# Altium project Quadcopter Fligth Controller Board.PrjPcb (part 4 of 7)
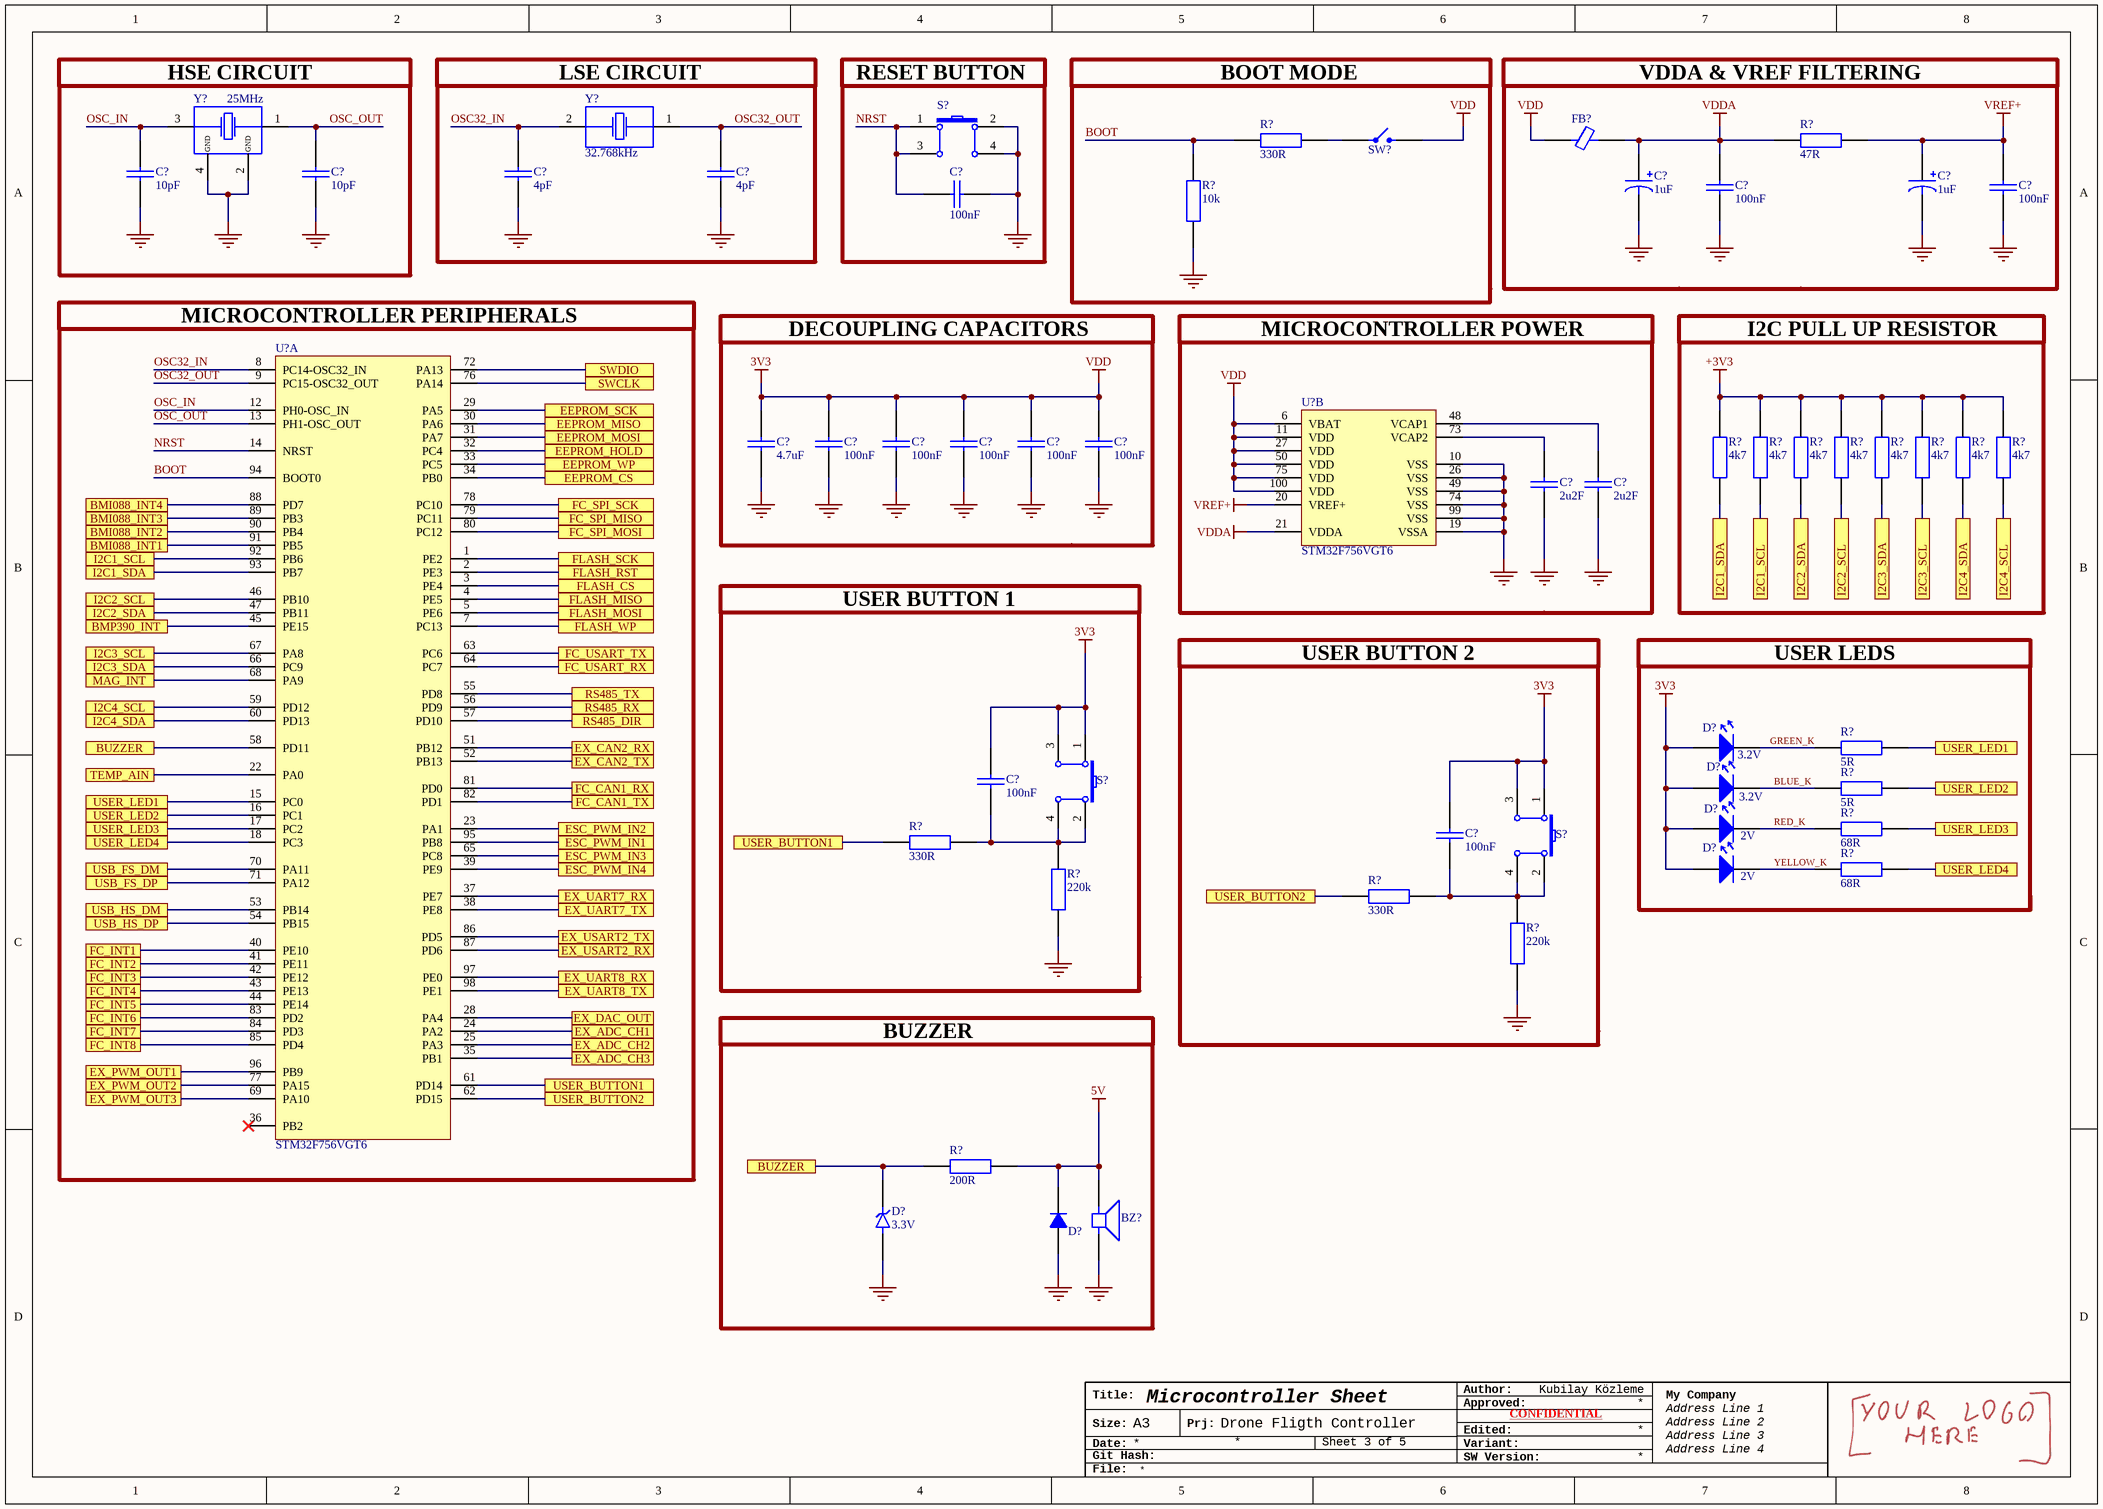
[diagram p6: Microcontroller.SchDoc]

## Sheet Microcontroller.SchDoc: Microcontroller Sheet (continued)

### Library data of the parts
BZ? = CT-1205CL-SMT-TR: 12.8 mm, 5 V, 88 dB, 2.4 kHz, Surface Mount (SMT), Driving Circuit, Magnetic Audio Indicator Buzzer; Manufacturer: CUI Devices; Shape: 4453Shape; Frequency: 2.4kHz; Operating Supply Current: 30mA; Voltage Rating: 5V; Sensing Method: 6241SensingMethod; Input Type: DC; Max Supply Voltage: 7V; Min Supply Voltage: 4V; Designed By: Kubilay Közleme; Supplier 1: Digikey; Manufacturer Part Number: CT-1205CL-SMT-TR; RoHS: No; Category: Buzzers; Stock 1: 39806; Pricing 1: 1=2.24, 10=1.826, 25=1.6836, 50=1.5836, 100=1.4898 (USD); Mount: Surface Mount; Case/Package: 4250Case; Min Operating Temperature: -30°C; Max Operating Temperature: 70°C; Termination: Solder; Packaging: 10Packaging; Series: CT; Current: 30mA; Operating Supply Voltage: 5V; Length: 12.8mm; Width: 12.8mm; Height: 7.6mm; Lead Free: 5697LeadFree; ComponentLink1URL: https://www.cuidevices.com/product/resource/digikeypdf/ct-1205cl-smt-tr.pdf?src-supplier=Digikey; ComponentLink1Description: https://www.cuidevices.com/product/resource/digikeypdf/ct-1205cl-smt-tr.pdf?src-supplier=Digikey; ComponentLink2URL: https://datasheet.octopart.com/CT-1205CL-SMT-TR-CUI-datasheet-16178015.pdf?src-supplier=Future+Electronics; ComponentLink2Description: https://datasheet.octopart.com/CT-1205CL-SMT-TR-CUI-datasheet-16178015.pdf?src-supplier=Future+Electronics; ComponentLink3URL: https://datasheet.octopart.com/CT-1205CL-SMT-TR-CUI-Devices-datasheet-141000055.pdf?src-supplier=Master+Electronics; ComponentLink3Description: https://datasheet.octopart.com/CT-1205CL-SMT-TR-CUI-Devices-datasheet-141000055.pdf?src-supplier=Master+Electronics; Supplier Part Number 1: 102-1267-6-ND
C?#29 C?#30 = CAP CER 10pF 0603: Ceramic Capacitor, Multilayer, Ceramic, 25V, 5% +Tol, 5% -Tol, C0G, 30ppm/Cel TC, 0.00001uF, Surface Mount, 0201; Manufacturer: KEMET; Multilayer: Yes; Designed By: Kubilay Közleme; Supplier 1: Digikey; Manufacturer Part Number: C0201C100D3GACTU; RoHS: Yes; Category: Ceramic Capacitors; Stock 1: 675000; Pricing 1: 15000=0.00535, 30000=0.00485, 45000=0.0046, 75000=0.00432, 105000=0.00416, 150000=0.004, 375000=0.00366, 750000=0.00345, 1500000=0.00328 (USD); Mount: Surface Mount; Number of Pins: 2; Dielectric Material: Ceramic; Package Shape: Rectangular; Size Code: 0201; Terminal Finish: Nickel; Min Operating Temperature: -55°C; Max Operating Temperature: 125°C; JESD-609 Code: e3; Capacitor Type: Ceramic; Negative Tolerance: 5%; Package Style: SMTMeter; Packaging: Tape and Reel; Positive Tolerance: 5%; Rated DC Voltage (URdc): 25V; Series: C(SIZE)C(C0G); Temperature Characteristics Code: C0G; Termination: Wraparound; Length: 0.6mm; Width: 0.3mm; Height: 0.3mm; Reach SVHC Compliant: Yes; RoHS Compliant: Yes; ComponentLink1URL: https://datasheet.ciiva.com:443/pdfs/VipMasterIC/IC/KEME/KEME-S-A0002525876/KEME-S-A0002525876-1.pdf?src-supplier=IHS+Markit; ComponentLink1Description: https://datasheet.ciiva.com:443/pdfs/VipMasterIC/IC/KEME/KEME-S-A0002525876/KEME-S-A0002525876-1.pdf?src-supplier=IHS+Markit; ComponentLink2URL: http://www.farnell.com/datasheets/2745865.pdf?src-supplier=Farnell; ComponentLink2Description: http://www.farnell.com/datasheets/2745865.pdf?src-supplier=Farnell; ComponentLink3URL: http://www.mouser.com/ds/2/212/KEM_C1003_C0G_SMD-1101588.pdf?src-supplier=Mouser; ComponentLink3Description: http://www.mouser.com/ds/2/212/KEM_C1003_C0G_SMD-1101588.pdf?src-supplier=Mouser; ComponentLink4URL: https://datasheet.octopart.com/C0201C100D3GACTU-KEMET-datasheet-81638339.pdf?src-supplier=Newark; ComponentLink4Description: https://datasheet.octopart.com/C0201C100D3GACTU-KEMET-datasheet-81638339.pdf?src-supplier=Newark; ComponentLink5URL: https://datasheet.octopart.com/C0201C100D3GACTU-Kemet-datasheet-62058854.pdf?src-supplier=Element14; ComponentLink5Description: https://datasheet.octopart.com/C0201C100D3GACTU-Kemet-datasheet-62058854.pdf?src-supplier=Element14; ComponentLink6URL: http://datasheet.octopart.com/C0201C100D3GACTU-KEMET-datasheet-68331921.pdf?src-supplier=Avnet; ComponentLink6Description: http://datasheet.octopart.com/C0201C100D3GACTU-KEMET-datasheet-68331921.pdf?src-supplier=Avnet; ComponentLink7URL: http://datasheet.octopart.com/C0201C100D3GACTU-KEMET-datasheet-68331921.pdf?src-supplier=Onlinecomponents.com; ComponentLink7Description: http://datasheet.octopart.com/C0201C100D3GACTU-KEMET-datasheet-68331921.pdf?src-supplier=Onlinecomponents.com; ComponentLink8URL: http://datasheet.octopart.com/C0201C100D3GACTU-KEMET-datasheet-68331921.pdf?src-supplier=Digikey; ComponentLink8Description: http://datasheet.octopart.com/C0201C100D3GACTU-KEMET-datasheet-68331921.pdf?src-supplier=Digikey; ComponentLink9URL: https://api.kemet.com/component-edge/download/datasheet/C0201C100D3GACTU.pdf?src-supplier=Digikey; ComponentLink9Description: https://api.kemet.com/component-edge/download/datasheet/C0201C100D3GACTU.pdf?src-supplier=Digikey; ComponentLink10URL: https://datasheet.octopart.com/C0201C100D3GACTU-KEMET-datasheet-165572914.pdf?src-supplier=TME; ComponentLink10Description: https://datasheet.octopart.com/C0201C100D3GACTU-KEMET-datasheet-165572914.pdf?src-supplier=TME; ComponentLink11URL: http://datasheet.octopart.com/C0201C100D3GACTU-KEMET-datasheet-68331921.pdf?src-supplier=TTI; ComponentLink11Description: http://datasheet.octopart.com/C0201C100D3GACTU-KEMET-datasheet-68331921.pdf?src-supplier=TTI; ComponentLink12URL: https://datasheet.octopart.com/C0201C100D3GACTU-KEMET-datasheet-157246123.pdf?src-supplier=Electro+Sonic; ComponentLink12Description: https://datasheet.octopart.com/C0201C100D3GACTU-KEMET-datasheet-157246123.pdf?src-supplier=Electro+Sonic
C?#31 C?#32 = CAP TANT 1uF 0805: Tantalum Capacitor, Polarized, Tantalum (solid Polymer), 35V, 20% +Tol, 20% -Tol, 1uF, Surface Mount, 0805; Manufacturer: Vishay; Designed By: Kubilay Közleme; Supplier 1: Digikey; Manufacturer Part Number: T58W9105M035C0500; RoHS: Yes; Category: Polymer Capacitors; Stock 1: 13915; Pricing 1: 1=0.5, 10=0.349, 50=0.2942, 100=0.2396, 500=0.19966, 1000=0.185 (USD); Number of Pins: 2; Dielectric Material: Polymer; Capacitor Type: Tantalum; RoHS Compliant: Yes; ComponentLink1URL: https://datasheet.ciiva.com:443/pdfs/VipMasterIC/IC/VISH/VISH-S-A0007978004/VISH-S-A0007978004-1.pdf?src-supplier=IHS+Markit; ComponentLink1Description: https://datasheet.ciiva.com:443/pdfs/VipMasterIC/IC/VISH/VISH-S-A0007978004/VISH-S-A0007978004-1.pdf?src-supplier=IHS+Markit; ComponentLink2URL: http://www.farnell.com/datasheets/2617265.pdf?src-supplier=Farnell; ComponentLink2Description: http://www.farnell.com/datasheets/2617265.pdf?src-supplier=Farnell; ComponentLink3URL: http://www.farnell.com/datasheets/2617265.pdf?src-supplier=Newark; ComponentLink3Description: http://www.farnell.com/datasheets/2617265.pdf?src-supplier=Newark; ComponentLink4URL: http://www.farnell.com/datasheets/2617265.pdf?src-supplier=Element14; ComponentLink4Description: http://www.farnell.com/datasheets/2617265.pdf?src-supplier=Element14; ComponentLink5URL: https://datasheet.octopart.com/T58W9105M035C0500-Vishay-datasheet-76796261.pdf?src-supplier=Element14; ComponentLink5Description: https://datasheet.octopart.com/T58W9105M035C0500-Vishay-datasheet-76796261.pdf?src-supplier=Element14; ComponentLink6URL: http://www.vishay.com/docs/40189/t58.pdf?src-supplier=Digikey; ComponentLink6Description: http://www.vishay.com/docs/40189/t58.pdf?src-supplier=Digikey; ComponentLink7URL: https://www.vishay.com/docs/40189/t58.pdf?src-supplier=Digikey; ComponentLink7Description: https://www.vishay.com/docs/40189/t58.pdf?src-supplier=Digikey; ComponentLink8URL: https://datasheet.octopart.com/T58W9105M035C0500-Vishay-datasheet-95510002.pdf?src-supplier=Future+Electronics; ComponentLink8Description: https://datasheet.octopart.com/T58W9105M035C0500-Vishay-datasheet-95510002.pdf?src-supplier=Future+Electronics; Supplier Part Number 1: 718-2209-6-ND
C?#33 C?#36 C?#37 C?#39-C?#43 C?#46 C?#47 = CAP CER 100nF 0603: Cap Cer 0603 0.1UF 100VDC X7R; Manufacturer: KEMET; Dielectric: 1511DielectricType; Voltage Rating (DC): 100V; Designed By: Kubilay Közleme; Supplier 1: Digikey; Manufacturer Part Number: C0603C104K1RACTU; RoHS: No; Category: Ceramic Capacitors; Stock 1: 10169; Pricing 1: 1=0.28, 10=0.185, 50=0.1296, 100=0.1047, 500=0.07782, 1000=0.06808 (USD); Case/Package: 345Case; Supplier Part Number 1: 399-C0603C104K1RACTUCT-ND
C?#34 C?#35 = CAP CER 4pF 0603: Ceramic Capacitor, Multilayer, Ceramic, 50V, 2.5% +Tol, 2.5% -Tol, C0G, -/+30ppm/Cel TC, 0.000004uF, Surface Mount, 0603; Manufacturer: KEMET; Multilayer: Yes; Designed By: Kubilay Közleme; Supplier 1: Digikey; Manufacturer Part Number: CBR06C409B5GAC; RoHS: Yes; Category: Ceramic Capacitors; Stock 1: 15317; Pricing 1: 1=0.18, 10=0.119, 50=0.075, 100=0.0601, 500=0.04338, 1000=0.03838 (USD); Mount: Surface Mount; Number of Pins: 2; Dielectric Material: Ceramic; Package Shape: Rectangular; Size Code: 0603; Min Operating Temperature: -55°C; Max Operating Temperature: 125°C; Capacitor Type: Ceramic; Negative Tolerance: 2.5%; Package Style: SMTMeter; Packaging: Tape and Reel; Positive Tolerance: 2.5%; Rated DC Voltage (URdc): 50V; Temperature Characteristics Code: C0G; Termination: Wraparound; Length: 1.6mm; Width: 0.8mm; Height: 0.8mm; Reach SVHC Compliant: Yes; RoHS Compliant: Yes; ComponentLink1URL: https://datasheet.ciiva.com:443/pdfs/VipMasterIC/IC/KEME/KEME-S-A0008534334/KEME-S-A0008534334-1.pdf?src-supplier=IHS+Markit; ComponentLink1Description: https://datasheet.ciiva.com:443/pdfs/VipMasterIC/IC/KEME/KEME-S-A0008534334/KEME-S-A0008534334-1.pdf?src-supplier=IHS+Markit; ComponentLink2URL: https://datasheet.ciiva.com/24220/kem-c1030-cbr-smd-346920-24220453.pdf?src-supplier=Mouser; ComponentLink2Description: https://datasheet.ciiva.com/24220/kem-c1030-cbr-smd-346920-24220453.pdf?src-supplier=Mouser; ComponentLink3URL: https://datasheet.ciiva.com/6259/kem-c1030-cbr-smd-6259846.pdf?src-supplier=Digikey; ComponentLink3Description: https://datasheet.ciiva.com/6259/kem-c1030-cbr-smd-6259846.pdf?src-supplier=Digikey; Supplier Part Number 1: 399-CBR06C409B5GACCT-ND
C?#38 = CAP CER 4.7uF 0805: Multilayer Ceramic Capacitor, 4.7 uF, 25 V, ± 10%, X5R, 0805 [2012 Metric]; Manufacturer: Samsung; Voltage Rating: 25V; Designed By: Kubilay Közleme; Supplier 1: Digikey; Manufacturer Part Number: CL21A475KAQNNNE; RoHS: Yes; Category: Ceramic Capacitors; Stock 1: 3035721; Pricing 1: 1=0.1, 10=0.069, 50=0.0414, 100=0.0326, 500=0.02408, 1000=0.01994 (USD); Mount: Surface Mount; Case/Package: 0805; Case Code (Metric): 2012; Case Code (Imperial): 0805; Material: Ceramic; Min Operating Temperature: -55°C; Max Operating Temperature: 85°C; Packaging: Tape and Reel; Tolerance: 10%; Dielectric: X5R; Voltage Rating (DC): 25V; Series: CL; Construction: Flat; Length: 2mm; Height: 1.25mm; Depth: 1.25mm; Radiation Hardening: No; Lead Free: Lead Free; RoHS Compliant: Yes; ComponentLink1URL: https://datasheet.ciiva.com/25798/cl21a475kaqnnne-25798882.pdf?src-supplier=Digikey; ComponentLink1Description: https://datasheet.ciiva.com/25798/cl21a475kaqnnne-25798882.pdf?src-supplier=Digikey; Supplier Part Number 1: 1276-1244-1-ND
C?#44 C?#45 = CAP CER 2.2uF 0603: Ceramic Capacitor, Multilayer, Ceramic, 16V, 10% +Tol, 10% -Tol, X5R, 15% TC, 2.2uF, Surface Mount, 0603; Manufacturer: Samsung; Multilayer: Yes; Designed By: Kubilay Közleme; Supplier 1: Digikey; Manufacturer Part Number: CL10A225KO8NNNC; RoHS: Yes; Category: Ceramic Capacitors; Stock 1: 909178; Pricing 1: 1=0.1, 10=0.06, 50=0.0346, 100=0.0269, 500=0.02022, 1000=0.01589 (USD); Mount: Surface Mount; Number of Pins: 2; Dielectric Material: Ceramic; Package Shape: Rectangular; Size Code: 0603; Terminal Finish: Nickel; Min Operating Temperature: -55°C; Max Operating Temperature: 85°C; JESD-609 Code: e3; Capacitor Type: Ceramic; Negative Tolerance: 10%; Package Style: SMTMeter; Packaging: Tape and Reel; Positive Tolerance: 10%; Rated DC Voltage (URdc): 16V; Temperature Characteristics Code: X5R; Termination: Wraparound; Length: 1.6mm; Width: 0.8mm; Height: 0.9mm; Reach SVHC Compliant: Yes; RoHS Compliant: Yes; ComponentLink1URL: https://datasheet.ciiva.com:443/pdfs/VipMasterIC/IC/SEMS/SEMS-S-A0008524842/SEMS-S-A0008524788-1.pdf?src-supplier=IHS+Markit; ComponentLink1Description: https://datasheet.ciiva.com:443/pdfs/VipMasterIC/IC/SEMS/SEMS-S-A0008524842/SEMS-S-A0008524788-1.pdf?src-supplier=IHS+Markit; ComponentLink2URL: https://datasheet.ciiva.com/25798/cl10a225ko8nnnc-25798421.pdf?src-supplier=Digikey; ComponentLink2Description: https://datasheet.ciiva.com/25798/cl10a225ko8nnnc-25798421.pdf?src-supplier=Digikey; ComponentLink3URL: https://datasheet.ciiva.com/26838/getdatasheetpartid-355165-26838356.pdf?src-supplier=Verical; ComponentLink3Description: https://datasheet.ciiva.com/26838/getdatasheetpartid-355165-26838356.pdf?src-supplier=Verical; ComponentLink4URL: https://datasheet.ciiva.com/29198/457919-da-01-en-vs-kondensator-0603-29198587.pdf?src-supplier=Conrad; ComponentLink4Description: https://datasheet.ciiva.com/29198/457919-da-01-en-vs-kondensator-0603-29198587.pdf?src-supplier=Conrad; ComponentLink5URL: https://datasheet.ciiva.com/16342/cl05b104kq5nnnc-16342714.pdf?src-supplier=Future+Electronics; ComponentLink5Description: https://datasheet.ciiva.com/16342/cl05b104kq5nnnc-16342714.pdf?src-supplier=Future+Electronics; Supplier Part Number 1: 1276-1040-6-ND
D?#2 = LED GREEN CLEAR 0603 SMD: Single Color LED, Green, Water Clear, 1.1mm; Manufacturer: Wurth Electronics; Shape: Rectangular; Forward Current-Max: 30mA; Luminous Intensity-Nom: 430mcd; Number of Functions: 1; Viewing Angle: 140°; Overall Height: 0.7mm; Designed By: Kubilay Közleme; Supplier 1: Digikey; Manufacturer Part Number: 150060GS75000; RoHS: Yes; Category: LEDs; Stock 1: 166680; Pricing 1: 1=0.15, 50=0.142, 100=0.122, 500=0.105 (USD); Mount: Surface Mount; Number of Pins: 2; Color: Green; Min Operating Temperature: -40°C; Max Operating Temperature: 85°C; Lens Style: WATER CLEAR; Optoelectronic Device Type: SINGLE COLOR LED; Packaging: Tape and Reel; Size: 1.1mm; Terminal Pitch: 1.6mm; Reach SVHC Compliant: Yes; RoHS Compliant: Yes; ComponentLink1URL: https://datasheet.ciiva.com:443/pdfs/VipMasterIC/IC/MIDC/MIDC-S-A0007790169/MIDC-S-A0007790169-1.pdf?src-supplier=IHS+Markit; ComponentLink1Description: https://datasheet.ciiva.com:443/pdfs/VipMasterIC/IC/MIDC/MIDC-S-A0007790169/MIDC-S-A0007790169-1.pdf?src-supplier=IHS+Markit; ComponentLink2URL: https://datasheet.ciiva.com/29562/150060gs75000-29562868.pdf?src-supplier=Digikey; ComponentLink2Description: https://datasheet.ciiva.com/29562/150060gs75000-29562868.pdf?src-supplier=Digikey; ComponentLink3URL: https://datasheet.ciiva.com/29279/759427-da-01-en-chipled-0603-w-kl-gruen-150060gs75000-29279201.pdf?src-supplier=Conrad; ComponentLink3Description: https://datasheet.ciiva.com/29279/759427-da-01-en-chipled-0603-w-kl-gruen-150060gs75000-29279201.pdf?src-supplier=Conrad; ComponentLink4URL: https://datasheet.ciiva.com/29562/150060gs75000-29562869.pdf?src-supplier=Digikey; ComponentLink4Description: https://datasheet.ciiva.com/29562/150060gs75000-29562869.pdf?src-supplier=Digikey; ComponentLink5URL: https://datasheet.ciiva.com/29562/150060gs75000-29562870.pdf?src-supplier=Digikey; ComponentLink5Description: https://datasheet.ciiva.com/29562/150060gs75000-29562870.pdf?src-supplier=Digikey; Supplier Part Number 1: 732-4971-1-ND
D?#3 = LED BLUE CLEAR 0603 SMD: Single Color LED, Blue, Water Clear, 1.1mm; Manufacturer: Wurth Electronics; Manufacturer Part Number: 150060BS75000; Shape: Rectangular; Forward Current-Max: 30mA; Luminous Intensity-Nom: 145mcd; Number of Functions: 1; Viewing Angle: 140°; Overall Height: 0.7mm; Designed By: Kubilay Közleme; Supplier 1: Digikey; RoHS: Yes; Category: LEDs; Stock 1: 59212; Pricing 1: 1=0.16, 50=0.155, 100=0.133, 500=0.115 (USD); Mount: Surface Mount; Number of Pins: 2; Color: Blue; Min Operating Temperature: -40°C; Max Operating Temperature: 85°C; Lens Style: WATER CLEAR; Optoelectronic Device Type: SINGLE COLOR LED; Packaging: Tape and Reel; Size: 1.1mm; Terminal Pitch: 1.6mm; Reach SVHC Compliant: Yes; RoHS Compliant: Yes; ComponentLink1URL: https://datasheet.ciiva.com:443/pdfs/VipMasterIC/IC/MIDC/MIDC-S-A0007768854/MIDC-S-A0007768854-1.pdf?src-supplier=IHS+Markit; ComponentLink1Description: https://datasheet.ciiva.com:443/pdfs/VipMasterIC/IC/MIDC/MIDC-S-A0007768854/MIDC-S-A0007768854-1.pdf?src-supplier=IHS+Markit; ComponentLink2URL: https://datasheet.ciiva.com/29563/150060bs75000-29563034.pdf?src-supplier=Digikey; ComponentLink2Description: https://datasheet.ciiva.com/29563/150060bs75000-29563034.pdf?src-supplier=Digikey; ComponentLink3URL: https://datasheet.ciiva.com/29279/759426-da-01-en-chipled-0603-w-kl-blau-150060bs75000-29279193.pdf?src-supplier=Conrad; ComponentLink3Description: https://datasheet.ciiva.com/29279/759426-da-01-en-chipled-0603-w-kl-blau-150060bs75000-29279193.pdf?src-supplier=Conrad; ComponentLink4URL: https://datasheet.ciiva.com/22656/1911343-22656939.pdf?src-supplier=Element14; ComponentLink4Description: https://datasheet.ciiva.com/22656/1911343-22656939.pdf?src-supplier=Element14; ComponentLink5URL: https://datasheet.ciiva.com/48430/150060bs75000-eng-tds-48430039.pdf?src-supplier=Distrelec; ComponentLink5Description: https://datasheet.ciiva.com/48430/150060bs75000-eng-tds-48430039.pdf?src-supplier=Distrelec; ComponentLink6URL: https://datasheet.ciiva.com/29563/150060bs75000-29563035.pdf?src-supplier=Digikey; ComponentLink6Description: https://datasheet.ciiva.com/29563/150060bs75000-29563035.pdf?src-supplier=Digikey; ComponentLink7URL: https://datasheet.ciiva.com/29563/150060bs75000-29563036.pdf?src-supplier=Digikey; ComponentLink7Description: https://datasheet.ciiva.com/29563/150060bs75000-29563036.pdf?src-supplier=Digikey; Supplier Part Number 1: 732-4966-6-ND
D?#4 = LED RED CLEAR 0603 SMD: Single Color LED, Red, Water Clear, 1.1mm; Manufacturer: Wurth Electronics; Shape: Rectangular; Forward Current-Max: 30mA; Luminous Intensity-Nom: 250mcd; Number of Functions: 1; Viewing Angle: 140°; Overall Height: 0.7mm; Designed By: Kubilay Közleme; Supplier 1: Digikey; Manufacturer Part Number: 150060RS75000; RoHS: Yes; Category: LEDs; Stock 1: 140000; Pricing 1: 4000=0.105 (USD); Mount: Surface Mount; Number of Pins: 2; Color: Red; Min Operating Temperature: -40°C; Max Operating Temperature: 85°C; Lens Style: WATER CLEAR; Optoelectronic Device Type: SINGLE COLOR LED; Packaging: Tape and Reel; Size: 1.1mm; Terminal Pitch: 1.6mm; Reach SVHC Compliant: Yes; RoHS Compliant: Yes; ComponentLink1URL: https://datasheet.ciiva.com:443/pdfs/VipMasterIC/IC/MIDC/MIDC-S-A0007768849/MIDC-S-A0007768849-1.pdf?src-supplier=IHS+Markit; ComponentLink1Description: https://datasheet.ciiva.com:443/pdfs/VipMasterIC/IC/MIDC/MIDC-S-A0007768849/MIDC-S-A0007768849-1.pdf?src-supplier=IHS+Markit; ComponentLink2URL: https://datasheet.ciiva.com/29563/150060rs75000-29563040.pdf?src-supplier=Digikey; ComponentLink2Description: https://datasheet.ciiva.com/29563/150060rs75000-29563040.pdf?src-supplier=Digikey; ComponentLink3URL: https://datasheet.ciiva.com/29279/759428-da-01-en-chipled-0603-w-kl-rot-150060rs75000-29279196.pdf?src-supplier=Conrad; ComponentLink3Description: https://datasheet.ciiva.com/29279/759428-da-01-en-chipled-0603-w-kl-rot-150060rs75000-29279196.pdf?src-supplier=Conrad; Supplier Part Number 1: 732-4978-2-ND
D?#5 = LED YELLOW CLEAR 0603 SMD: Single Color LED, Yellow, Water Clear, 1.1mm; Manufacturer: Wurth Electronics; Manufacturer Part Number: 150060YS75000; Shape: Rectangular; Forward Current-Max: 30mA; Luminous Intensity-Nom: 120mcd; Number of Functions: 1; Viewing Angle: 140°; Overall Height: 0.7mm; Designed By: Kubilay Közleme; Supplier 1: Digikey; RoHS: Yes; Category: LEDs; Stock 1: 45913; Pricing 1: 1=0.15, 50=0.142, 100=0.122, 500=0.105 (USD); Mount: Surface Mount; Number of Pins: 2; Color: Yellow; Min Operating Temperature: -40°C; Max Operating Temperature: 85°C; Lens Style: WATER CLEAR; Optoelectronic Device Type: SINGLE COLOR LED; Packaging: Tape and Reel; Size: 1.1mm; Terminal Pitch: 1.6mm; Reach SVHC Compliant: Yes; RoHS Compliant: Yes; ComponentLink1URL: https://datasheet.ciiva.com:443/pdfs/VipMasterIC/IC/MIDC/MIDC-S-A0007768628/MIDC-S-A0007768628-1.pdf?src-supplier=IHS+Markit; ComponentLink1Description: https://datasheet.ciiva.com:443/pdfs/VipMasterIC/IC/MIDC/MIDC-S-A0007768628/MIDC-S-A0007768628-1.pdf?src-supplier=IHS+Markit; ComponentLink2URL: https://datasheet.ciiva.com/23843/150060ys75000-23843250.pdf?src-supplier=Newark; ComponentLink2Description: https://datasheet.ciiva.com/23843/150060ys75000-23843250.pdf?src-supplier=Newark; ComponentLink3URL: https://datasheet.ciiva.com/29279/759432-da-01-en-chipled-0603-w-kl-gelb-150060ys75000-29279206.pdf?src-supplier=Conrad; ComponentLink3Description: https://datasheet.ciiva.com/29279/759432-da-01-en-chipled-0603-w-kl-gelb-150060ys75000-29279206.pdf?src-supplier=Conrad; ComponentLink4URL: https://datasheet.ciiva.com/22656/1911348-22656951.pdf?src-supplier=Element14; ComponentLink4Description: https://datasheet.ciiva.com/22656/1911348-22656951.pdf?src-supplier=Element14; ComponentLink5URL: https://datasheet.ciiva.com/48430/150060ys75000-eng-tds-48430044.pdf?src-supplier=Distrelec; ComponentLink5Description: https://datasheet.ciiva.com/48430/150060ys75000-eng-tds-48430044.pdf?src-supplier=Distrelec; ComponentLink6URL: https://datasheet.ciiva.com/29563/150060ys75000-29563045.pdf?src-supplier=Digikey; ComponentLink6Description: https://datasheet.ciiva.com/29563/150060ys75000-29563045.pdf?src-supplier=Digikey; ComponentLink7URL: https://datasheet.ciiva.com/29563/150060ys75000-29563033.pdf?src-supplier=Digikey; ComponentLink7Description: https://datasheet.ciiva.com/29563/150060ys75000-29563033.pdf?src-supplier=Digikey; Supplier Part Number 1: 732-4981-6-ND
D?#6 = 1N4148WS: Diode Ultra Fast Recovery Rectifier 75V 0.15A; Manufacturer: ON Semiconductor / Fairchild; Max Forward Surge Current (Ifsm): 2A; Forward Current: 150mA; Max Reverse Current: 5uA; Capacitance: 4pF; Reverse Recovery Time: 4ns; Element Configuration: Single; Designed By: Kubilay Közleme; Supplier 1: Digikey; Manufacturer Part Number: 1N4148WS; RoHS: Yes; Category: Rectifier Diodes; Stock 1: 304046; Pricing 1: 1=0.17, 10=0.104, 100=0.0639, 500=0.04644, 1000=0.04076 (USD); Mount: Surface Mount; Number of Pins: 2; Weight: 0.0276g; Min Operating Temperature: -55°C; Max Operating Temperature: 150°C; Max Repetitive Reverse Voltage (Vrrm): 75V; Reverse Voltage: 75V; Packaging: Tape and Reel; Average Rectified Current: 150mA; Max Reverse Voltage (DC): 75V; Series: -; Package Quantity: 1; Recovery Time: 4ns; Length: 1.8mm; Width: 1.35mm; Height: 1mm; Radiation Hardening: No; RoHS Compliant: Yes; Reach SVHC Compliant: No; Lead Free: 5697LeadFree; ComponentLink1URL: https://datasheet.ciiva.com/15208/getdatasheetpartid-127819-15208358.pdf?src-supplier=Verical; ComponentLink1Description: https://datasheet.ciiva.com/15208/getdatasheetpartid-127819-15208358.pdf?src-supplier=Verical; Supplier Part Number 1: 1N4148WSFSCT-ND
D?#7 = MMSZ4684T1G: Diode Zener Single 3.3V 5% 500mW Automotive 2-Pin SOD-123 T/R; Manufacturer: ON Semiconductor; Forward Voltage: 900mV; Max Reverse Leakage Current: 7.5uA; Zener Current: 50uA; Designed By: Kubilay Közleme; Supplier 1: Newark; Manufacturer Part Number: MMSZ4684T1G; RoHS: Yes; Category: Zener Diodes; Stock 1: 27354; Pricing 1: 1=0.022, 25=0.022, 50=0.022, 100=0.022, 250=0.022, 500=0.022, 1000=0.022 (USD); Case/Package: SOD-123-2; Number of Pins: 2; Min Operating Temperature: -55°C; Max Operating Temperature: 150°C; Package Quantity: 3000; Tolerance: 5%; Max Power Dissipation: 500mW; Packaging: Tape and Reel; Voltage Tolerance: 5%; Power Dissipation: 500mW; Test Current: 50uA; Working Voltage: 3.3V; Max Reverse Current: 7.5uA; Series: -; Length: 2.69mm; Width: 1.6mm; Height: 1.12mm; Radiation Hardening: No; Reach SVHC Compliant: No; RoHS Compliant: Yes; ComponentLink1URL: https://datasheet.ciiva.com/27056/2011643-27056163.pdf?src-supplier=Jameco; ComponentLink1Description: https://datasheet.ciiva.com/27056/2011643-27056163.pdf?src-supplier=Jameco; ComponentLink2URL: https://datasheet.ciiva.com/8026/mmsz4678t1-d-8026831.pdf?src-supplier=Element14; ComponentLink2Description: https://datasheet.ciiva.com/8026/mmsz4678t1-d-8026831.pdf?src-supplier=Element14; ComponentLink3URL: https://datasheet.ciiva.com/22697/1796559-22697911.pdf?src-supplier=Element14; ComponentLink3Description: https://datasheet.ciiva.com/22697/1796559-22697911.pdf?src-supplier=Element14; ComponentLink4URL: https://datasheet.ciiva.com/8346/mmsz4678t1-d-8346063.pdf?src-supplier=Avnet; ComponentLink4Description: https://datasheet.ciiva.com/8346/mmsz4678t1-d-8346063.pdf?src-supplier=Avnet; Supplier Part Number 1: 45J1578
FB?#2 = FCM 1608KF-601T03: 600 Ohms @ 100 Mhz 1 Power, Sign; Manufacturer: Tai Tech; Designed By: Kubilay Közleme; Supplier 1: Digikey; Manufacturer Part Number: FCM1608KF-601T03; RoHS: No; Category: Ferrite Beads and Chips; Stock 1: 32683; Pricing 1: 1=0.1, 10=0.025, 25=0.0224, 50=0.0202, 100=0.0182, 250=0.01332, 500=0.0097, 1000=0.00949 (USD); Supplier Part Number 1: 4816-FCM1608KF-601T03CT-ND
R?#10 R?#24 R?#26 = RES 330 OHM 0603: Fixed Resistor, Metal Glaze/thick Film, 0.1W, 330ohm, 75V, 5% +/-Tol, 100ppm/Cel, Surface Mount, 0603; Manufacturer: Yageo; Additional Feature: LASER TRIMMABLE; Rated Power Dissipation (P): 100mW; Rated Temperature: 70°C; Temperature Coefficient: 100ppm/°C; Package Height: 0.45mm; Package Length: 1.6mm; Package Width: 0.8mm; Designed By: Kubilay Közleme; Supplier 1: Digikey; Manufacturer Part Number: RC0603JR-07330RL; RoHS: Yes; Category: Chip SMD Resistors; Stock 1: 2658618; Pricing 1: 1=0.1, 10=0.011, 50=0.0066, 100=0.0054, 500=0.00364, 1000=0.0031 (USD); Mount: Surface Mount; Number of Pins: 2; Package Shape: Rectangular; Size Code: 0603; Terminal Finish: Nickel; Min Operating Temperature: -55°C; Max Operating Temperature: 155°C; Tolerance: 5%; JESD-609 Code: e3; Resistor Type: FIXED RESISTOR; Construction: Chip; Package Style: SMTMeter; Packaging: Tape and Reel; Technology: METAL GLAZE/THICK FILM; Termination: Wraparound; Working Voltage: 75V; Reach SVHC Compliant: Yes; RoHS Compliant: Yes; ComponentLink1URL: https://datasheet.ciiva.com:443/pdfs/VipMasterIC/IC/YAGO/YAGO-S-A0008145938/YAGO-S-A0008145938-1.pdf?src-supplier=IHS+Markit; ComponentLink1Description: https://datasheet.ciiva.com:443/pdfs/VipMasterIC/IC/YAGO/YAGO-S-A0008145938/YAGO-S-A0008145938-1.pdf?src-supplier=IHS+Markit; ComponentLink2URL: https://datasheet.ciiva.com/46395/443971-46395145.pdf?src-supplier=Element14; ComponentLink2Description: https://datasheet.ciiva.com/46395/443971-46395145.pdf?src-supplier=Element14; ComponentLink3URL: https://datasheet.ciiva.com/12558/rc0603-272842-12558685.pdf?src-supplier=Mouser; ComponentLink3Description: https://datasheet.ciiva.com/12558/rc0603-272842-12558685.pdf?src-supplier=Mouser; ComponentLink4URL: https://datasheet.ciiva.com/7746/1868787-7746487.pdf?src-supplier=Element14; ComponentLink4Description: https://datasheet.ciiva.com/7746/1868787-7746487.pdf?src-supplier=Element14; ComponentLink5URL: https://datasheet.ciiva.com/7746/443971-7746488.pdf?src-supplier=Element14; ComponentLink5Description: https://datasheet.ciiva.com/7746/443971-7746488.pdf?src-supplier=Element14; Supplier Part Number 1: 311-330GRDKR-ND
R?#11 = RES 47 OHM 0603: Fixed Resistor, Metal Glaze/thick Film, 0.1W, 47ohm, 75V, 1% +/-Tol, 100ppm/Cel, Surface Mount, 0603; Manufacturer: Yageo; Additional Feature: LASER TRIMMABLE; Rated Power Dissipation (P): 100mW; Rated Temperature: 70°C; Temperature Coefficient: 100ppm/°C; Package Height: 0.45mm; Package Length: 1.6mm; Package Width: 0.8mm; Designed By: Kubilay Közleme; Supplier 1: Digikey; Manufacturer Part Number: RC0603FR-0747RL; RoHS: Yes; Category: Chip SMD Resistors; Stock 1: 662719; Pricing 1: 1=0.1, 10=0.019, 50=0.0116, 100=0.0095, 500=0.00638, 1000=0.00544 (USD); Mount: Surface Mount; Number of Pins: 2; Package Shape: Rectangular; Size Code: 0603; Terminal Finish: Nickel; Min Operating Temperature: -55°C; Max Operating Temperature: 155°C; Tolerance: 1%; JESD-609 Code: e3; Resistor Type: FIXED RESISTOR; Construction: Chip; Package Style: SMTMeter; Packaging: Tape and Reel; Technology: METAL GLAZE/THICK FILM; Termination: Wraparound; Working Voltage: 75V; Reach SVHC Compliant: Yes; RoHS Compliant: Yes; ComponentLink1URL: https://datasheet.ciiva.com:443/pdfs/VipMasterIC/IC/YAGO/YAGO-S-A0008145938/YAGO-S-A0008145938-1.pdf?src-supplier=IHS+Markit; ComponentLink1Description: https://datasheet.ciiva.com:443/pdfs/VipMasterIC/IC/YAGO/YAGO-S-A0008145938/YAGO-S-A0008145938-1.pdf?src-supplier=IHS+Markit; ComponentLink2URL: https://datasheet.ciiva.com/7746/443971-7746364.pdf?src-supplier=Element14; ComponentLink2Description: https://datasheet.ciiva.com/7746/443971-7746364.pdf?src-supplier=Element14; Supplier Part Number 1: 311-47.0HRDKR-ND
R?#12 = RES 10K OHM 0603: SMD Chip Resistor, 10 kOhm, ï¿½ 1%, 100 mW, 0603 [1608 Metric], Thick Film, General Purpose; Manufacturer: Yageo; Temperature Coefficient: 100ppm/°C; Voltage Rating (DC): 50V; Power Rating: 100mW; Voltage Rating: 75V; Designed By: Kubilay Közleme; Supplier 1: Digikey; Manufacturer Part Number: RC0603FR-0710KL; RoHS: Yes; Category: Chip SMD Resistors; Stock 1: 9310839; Pricing 1: 1=0.1, 10=0.019, 50=0.0112, 100=0.0093, 500=0.00622, 1000=0.00532 (USD); Case/Package: 0603; Number of Pins: 2; Case Code (Imperial): 0603; Case Code (Metric): 1608; Weight: 7.1E-05oz; Size Code: 0603; Min Operating Temperature: -55°C; Max Operating Temperature: 155°C; Tolerance: 1%; Resistor Type: Thick Film; Packaging: Tape and Reel; Termination: SMD/SMT; Features: Moisture Resistant; Series: RC; Max Power Dissipation: 100mW; Number of Terminations: 2; Resistance Tolerance: 1%; Construction: Rectangular; Length: 1.6mm; Width: 0.8mm; Height: 0.45mm; Depth: 0.8mm; Lead Pitch: 0.3mm; Reach SVHC Compliant: No; Lead Free: 5697LeadFree; Military Standard: Not; RoHS Compliant: Yes; ComponentLink1URL: https://datasheet.ciiva.com/7660/38590-7660789.pdf?src-supplier=Element14; ComponentLink1Description: https://datasheet.ciiva.com/7660/38590-7660789.pdf?src-supplier=Element14; ComponentLink2URL: https://datasheet.ciiva.com/7983/443971-7983596.pdf?src-supplier=Element14; ComponentLink2Description: https://datasheet.ciiva.com/7983/443971-7983596.pdf?src-supplier=Element14; ComponentLink3URL: https://datasheet.ciiva.com/22747/443971-22747519.pdf?src-supplier=Element14; ComponentLink3Description: https://datasheet.ciiva.com/22747/443971-22747519.pdf?src-supplier=Element14; ComponentLink4URL: https://datasheet.ciiva.com/46440/1868787-46440891.pdf?src-supplier=Element14; ComponentLink4Description: https://datasheet.ciiva.com/46440/1868787-46440891.pdf?src-supplier=Element14; ComponentLink5URL: https://datasheet.ciiva.com/7746/1738695-7746239.pdf?src-supplier=Element14; ComponentLink5Description: https://datasheet.ciiva.com/7746/1738695-7746239.pdf?src-supplier=Element14; ComponentLink6URL: https://datasheet.ciiva.com/15189/getdatasheetpartid-409289-15189591.pdf?src-supplier=Verical; ComponentLink6Description: https://datasheet.ciiva.com/15189/getdatasheetpartid-409289-15189591.pdf?src-supplier=Verical; Supplier Part Number 1: 311-10.0KHRCT-ND
R?#13-R?#20 = RES 4K7 0603: SMD Chip Resistor, 4.7 kOhm, ± 5%, 100 mW, 0603 [1608 Metric], Thick Film, General Purpose; Manufacturer: Yageo; Voltage Rating (DC): 50V; Temperature Coefficient: 100ppm/°C; Power Rating: 100mW; Designed By: Kubilay Közleme; Supplier 1: Digikey; Manufacturer Part Number: RC0603JR-074K7L; RoHS: Yes; Category: Chip SMD Resistors; Stock 1: 4549131; Pricing 1: 1=0.1, 10=0.015, 50=0.0092, 100=0.0076, 500=0.00512, 1000=0.00437 (USD); Case/Package: 0603; Number of Pins: 2; Case Code (Imperial): 0603; Case Code (Metric): 1608; Size Code: 0603; Min Operating Temperature: -55°C; Max Operating Temperature: 155°C; Resistor Type: Thick Film; Tolerance: 5%; Voltage Rating: 50V; Packaging: Tape and Reel; Termination: SMD/SMT; Features: Moisture Resistant; Max Power Dissipation: 100mW; Number of Terminations: 2; Series: RC; Resistance Tolerance: 5%; Construction: Rectangular; Voltage Rating (AC): 50V; Length: 1.6mm; Width: 0.8mm; Depth: 0.8mm; Reach SVHC Compliant: No; RoHS Compliant: Yes; Lead Free: 5697LeadFree; Military Standard: Not; ComponentLink1URL: https://datasheet.ciiva.com/46412/443971-46412858.pdf?src-supplier=Element14; ComponentLink1Description: https://datasheet.ciiva.com/46412/443971-46412858.pdf?src-supplier=Element14; Supplier Part Number 1: 311-4.7KGRCT-ND
R?#21 R?#22 = RES 5 OHM 0603: Fixed Resistor, Thin Film, 0.4W, 5ohm, 1% +/-Tol, 50ppm/Cel, Surface Mount, 0603; Manufacturer: Stackpole Electronics; Designed By: Kubilay Közleme; Supplier 1: Digikey; Manufacturer Part Number: CSRT0603FT5R00; RoHS: Yes; Category: Chip SMD Resistors; Stock 1: 18726; Pricing 1: 1=0.26, 10=0.211, 25=0.1616, 50=0.1172, 100=0.0824, 250=0.06664, 500=0.05252, 1000=0.03636 (USD); Supplier Part Number 1: 738-CSRT0603FT5R00DKR-ND
R?#23 R?#25 = RES 68 OHM 0603: Fixed Resistor, Metal Glaze/thick Film, 0.1W, 68ohm, 75V, 1% +/-Tol, 100ppm/Cel, Surface Mount, 0603; Manufacturer: Yageo; Designed By: Kubilay Közleme; Additional Feature: LASER TRIMMABLE; Rated Power Dissipation (P): 100mW; Rated Temperature: 70°C; Temperature Coefficient: 100ppm/°C; Package Height: 0.45mm; Package Length: 1.6mm; Package Width: 0.8mm; Supplier 1: Digikey; Manufacturer Part Number: RC0603FR-0768RL; RoHS: Yes; Category: Chip SMD Resistors; Stock 1: 432379; Pricing 1: 1=0.1, 10=0.019, 50=0.0112, 100=0.0093, 500=0.00622, 1000=0.00532 (USD); Mount: Surface Mount; Number of Pins: 2; Package Shape: Rectangular; Size Code: 0603; Terminal Finish: Nickel; Min Operating Temperature: -55°C; Max Operating Temperature: 155°C; Tolerance: 1%; JESD-609 Code: e3; Resistor Type: FIXED RESISTOR; Construction: Chip; Package Style: SMTMeter; Packaging: Tape and Reel; Technology: METAL GLAZE/THICK FILM; Termination: Wraparound; Working Voltage: 75V; Reach SVHC Compliant: Yes; RoHS Compliant: Yes; ComponentLink1URL: https://datasheet.ciiva.com:443/pdfs/VipMasterIC/IC/YAGO/YAGO-S-A0008145938/YAGO-S-A0008145938-1.pdf?src-supplier=IHS+Markit; ComponentLink1Description: https://datasheet.ciiva.com:443/pdfs/VipMasterIC/IC/YAGO/YAGO-S-A0008145938/YAGO-S-A0008145938-1.pdf?src-supplier=IHS+Markit; ComponentLink2URL: https://datasheet.ciiva.com/11809/0900766b80f96399-11809282.pdf?src-supplier=Rs; ComponentLink2Description: https://datasheet.ciiva.com/11809/0900766b80f96399-11809282.pdf?src-supplier=Rs; ComponentLink3URL: https://datasheet.ciiva.com/2454/pyu-r-int-thick-7-2454067.pdf?src-supplier=Digikey; ComponentLink3Description: https://datasheet.ciiva.com/2454/pyu-r-int-thick-7-2454067.pdf?src-supplier=Digikey; ComponentLink4URL: https://datasheet.ciiva.com/2454/pyu-r-int-thick-7-2454068.pdf?src-supplier=Digikey; ComponentLink4Description: https://datasheet.ciiva.com/2454/pyu-r-int-thick-7-2454068.pdf?src-supplier=Digikey; ComponentLink5URL: https://datasheet.ciiva.com/2454/pyu-r-int-thick-7-2454066.pdf?src-supplier=Digikey; ComponentLink5Description: https://datasheet.ciiva.com/2454/pyu-r-int-thick-7-2454066.pdf?src-supplier=Digikey; ComponentLink6URL: https://datasheet.ciiva.com/7746/443971-7746393.pdf?src-supplier=Element14; ComponentLink6Description: https://datasheet.ciiva.com/7746/443971-7746393.pdf?src-supplier=Element14; ComponentLink7URL: https://datasheet.ciiva.com/7746/443971-7746392.pdf?src-supplier=Element14; ComponentLink7Description: https://datasheet.ciiva.com/7746/443971-7746392.pdf?src-supplier=Element14; ComponentLink8URL: https://datasheet.ciiva.com/15189/getdatasheetpartid-325369-15189803.pdf?src-supplier=Verical; ComponentLink8Description: https://datasheet.ciiva.com/15189/getdatasheetpartid-325369-15189803.pdf?src-supplier=Verical; Supplier Part Number 1: 311-68.0HRDKR-ND
R?#27 R?#28 = RES 220K OHM 0603: SMD Chip Resistor, 220 kOhm, ± 5%, 100 mW, 0603 [1608 Metric], Thick Film, General Purpose; Manufacturer: Yageo; Voltage Rating (AC): 50V; Designed By: Kubilay Közleme; Supplier 1: Digikey; Manufacturer Part Number: RC0603JR-07220KL; RoHS: Yes; Category: Chip SMD Resistors; Stock 1: 636621; Pricing 1: 1=0.1, 10=0.015, 50=0.0092, 100=0.0076, 500=0.00512, 1000=0.00437 (USD); Lead Free: 5697LeadFree; ComponentLink1URL: https://datasheet.ciiva.com/2452/pyu-r-int-thick-7-2452923.pdf?src-supplier=Digikey; ComponentLink1Description: https://datasheet.ciiva.com/2452/pyu-r-int-thick-7-2452923.pdf?src-supplier=Digikey; ComponentLink2URL: https://datasheet.ciiva.com/2452/pyu-r-int-thick-7-2452924.pdf?src-supplier=Digikey; ComponentLink2Description: https://datasheet.ciiva.com/2452/pyu-r-int-thick-7-2452924.pdf?src-supplier=Digikey; ComponentLink3URL: https://datasheet.ciiva.com/2452/pyu-r-int-thick-7-2452925.pdf?src-supplier=Digikey; ComponentLink3Description: https://datasheet.ciiva.com/2452/pyu-r-int-thick-7-2452925.pdf?src-supplier=Digikey; Supplier Part Number 1: 311-220KGRCT-ND
R?#29 = RES 200 OHM 0805: Res Thick Film 0805 2 Ohm 1% 0.125W(1/8W) ±200ppm/C Pad SMD T/R; Manufacturer: Yageo; Manufacturer Part Number: RC0805FR-072RL; Designed By: Kubilay Közleme; Supplier 1: Digikey; RoHS: Yes; Category: Chip SMD Resistors; Stock 1: 215630; Pricing 1: 1=0.1, 10=0.043, 50=0.0282, 100=0.0238, 500=0.01678, 1000=0.01462 (USD); ComponentLink1URL: https://datasheet.ciiva.com/11808/0900766b8106beab-11808587.pdf?src-supplier=Rs; ComponentLink1Description: https://datasheet.ciiva.com/11808/0900766b8106beab-11808587.pdf?src-supplier=Rs; Supplier Part Number 1: 311-2.00CRCT-ND
S?#1-S?#3 = PTS 647 SN50 SMTR2 LFS: Keypad Switch, 1 Switches, SPST, Momentary-tactile, 0.05A, 12VDC, 1.47N, Solder Terminal, Surface Mount-straight; Manufacturer: ITT C&K; Designed By: Kubilay Közleme; Supplier 1: Digikey; Manufacturer Part Number: PTS647SN50SMTR2LFS; RoHS: No; Category: Tactile Switches; Stock 1: 526788; Pricing 1: 1=0.18, 10=0.175, 25=0.166, 100=0.1503, 250=0.137, 500=0.12734 (USD); RoHS Compliant: Yes; ComponentLink1URL: https://www.ckswitches.com/media/2567/pts647.pdf?src-supplier=Digikey; ComponentLink1Description: https://www.ckswitches.com/media/2567/pts647.pdf?src-supplier=Digikey; ComponentLink2URL: https://datasheet.octopart.com/PTS647SN50SMTR2LFS-C%26K-Components-datasheet-117317067.pdf?src-supplier=Future+Electronics; ComponentLink2Description: https://datasheet.octopart.com/PTS647SN50SMTR2LFS-C%26K-Components-datasheet-117317067.pdf?src-supplier=Future+Electronics; ComponentLink3URL: https://datasheet.octopart.com/PTS647SN50SMTR2LFS-C%26K-Components-datasheet-156105943.pdf?src-supplier=TME; ComponentLink3Description: https://datasheet.octopart.com/PTS647SN50SMTR2LFS-C%26K-Components-datasheet-156105943.pdf?src-supplier=TME; Supplier Part Number 1: PTS647SN50SMTR2LFSDKR-ND
SW? = CHS-01TA: Slide Dip Switch, 1 Switches, SPST, Latched, 0.1A, 6VDC, Solder Terminal, Surface Mount-straight; Manufacturer: Nidec Copal; Additional Feature: Low Profile; Contact Current(DC)-Max: 100mA; Contact DC Max Rating R Load: .1A@6VDC; Contact Voltage(DC)-Max: 6V; Number of Switch Sections: 1; Body Breadth: 2.5inch; Body Height: 2.5mm; Body Length or Diameter: 5.4mm; Sealing: WATERPROOF; Designed By: Kubilay Közleme; Supplier 1: Digikey; Manufacturer Part Number: CHS-01TA; RoHS: Yes; Category: DIP Switches; Stock 1: 31000; Pricing 1: 1000=0.71104, 3000=0.64438, 5000=0.59994, 10000=0.5555 (USD); Mount: Surface Mount; Terminal Finish: Gold; Min Operating Temperature: -40°C; Max Operating Temperature: 85°C; JESD-609 Code: e4; Packaging: Tape and Reel; Switch Action: LATCHED; Switch Function: SPST; Switch Type: Slide Dip; Termination: Solder; Reach SVHC Compliant: Yes; RoHS Compliant: Yes; ComponentLink1URL: https://datasheet.ciiva.com:443/pdfs/VipMasterIC/IC/NIDC/NIDC-S-A0003711409/NIDC-S-A0003711409-1.pdf?src-supplier=IHS+Markit; ComponentLink1Description: https://datasheet.ciiva.com:443/pdfs/VipMasterIC/IC/NIDC/NIDC-S-A0003711409/NIDC-S-A0003711409-1.pdf?src-supplier=IHS+Markit; ComponentLink2URL: https://datasheet.ciiva.com/2863/chs-2863449.pdf?src-supplier=Digikey; ComponentLink2Description: https://datasheet.ciiva.com/2863/chs-2863449.pdf?src-supplier=Digikey; ComponentLink3URL: https://datasheet.ciiva.com/2863/chs-2863448.pdf?src-supplier=Digikey; ComponentLink3Description: https://datasheet.ciiva.com/2863/chs-2863448.pdf?src-supplier=Digikey; ComponentLink4URL: https://datasheet.ciiva.com/2863/chs-2863450.pdf?src-supplier=Digikey; ComponentLink4Description: https://datasheet.ciiva.com/2863/chs-2863450.pdf?src-supplier=Digikey; Supplier Part Number 1: 563-1003-2-ND
U?#3 U?#4 = STM32F756VGT6: MCU 32-bit ARM Cortex M7 RISC 1MB Flash 1.8V/2.5V/3.3V Medical 100-Pin LQFP Frame; Manufacturer: STMicroelectronics; Supplier 1: Digikey; RoHS: Yes; Category: Microcontrollers; Stock 1: 522; Pricing 1: 1=12.48, 10=11.472, 25=10.9968, 80=10.465 (USD); ComponentLink1URL: http://www.farnell.com/datasheets/2013268.pdf?src-supplier=Farnell; ComponentLink1Description: http://www.farnell.com/datasheets/2013268.pdf?src-supplier=Farnell; ComponentLink2URL: http://www.alliedelec.com/images/products/datasheets/bm/STMICROELECTRONICS/70612623.pdf?src-supplier=Allied+Electronics; ComponentLink2Description: http://www.alliedelec.com/images/products/datasheets/bm/STMICROELECTRONICS/70612623.pdf?src-supplier=Allied+Electronics; ComponentLink3URL: http://www.mouser.com/ds/2/389/stm32f756bg-956217.pdf?src-supplier=Mouser; ComponentLink3Description: http://www.mouser.com/ds/2/389/stm32f756bg-956217.pdf?src-supplier=Mouser; ComponentLink4URL: https://datasheet.octopart.com/STM32F756VGT6-STMicroelectronics-datasheet-62057956.pdf?src-supplier=Newark; ComponentLink4Description: https://datasheet.octopart.com/STM32F756VGT6-STMicroelectronics-datasheet-62057956.pdf?src-supplier=Newark; ComponentLink5URL: https://datasheet.octopart.com/STM32F756VGT6-STMicroelectronics-datasheet-62336759.pdf?src-supplier=Future+Electronics; ComponentLink5Description: https://datasheet.octopart.com/STM32F756VGT6-STMicroelectronics-datasheet-62336759.pdf?src-supplier=Future+Electronics; ComponentLink6URL: http://www.st.com/content/ccc/resource/technical/document/datasheet/fb/d4/56/db/60/61/4f/9c/DM00166114.pdf/files/DM00166114.pdf/jcr:content/translations/en.DM00166114.pdf?src-supplier=Digikey; ComponentLink6Description: http://www.st.com/content/ccc/resource/technical/document/datasheet/fb/d4/56/db/60/61/4f/9c/DM00166114.pdf/files/DM00166114.pdf/jcr:content/translations/en.DM00166114.pdf?src-supplier=Digikey; ComponentLink7URL: https://datasheet.octopart.com/STM32F756VGT6-STMicroelectronics-datasheet-41841806.pdf?src-supplier=Element14; ComponentLink7Description: https://datasheet.octopart.com/STM32F756VGT6-STMicroelectronics-datasheet-41841806.pdf?src-supplier=Element14; Supplier Part Number 1: 497-16617-ND; Manufacturer Part Number: STM32F756VGT6
Y?#1 = ECS-250-10-37B-CTN-TR: Parallel - Fundamental Quartz Crystal, 25MHz Nom; Manufacturer: ECS International; Designed By: Kubilay Közleme; Supplier 1: Digikey; Manufacturer Part Number: ECS-250-10-37B-CTN-TR; RoHS: Yes; Category: LDO; Stock 1: 57998; Pricing 1: 1=0.45, 10=0.387, 50=0.349, 100=0.3337, 500=0.30092 (USD); RoHS Compliant: Yes; ComponentLink1URL: https://datasheet.ciiva.com:443/pdfs/VipMasterIC/IC/ECSI/ECSI-S-A0007299405/ECSI-S-A0007299405-1.pdf?src-supplier=IHS+Markit; ComponentLink1Description: https://datasheet.ciiva.com:443/pdfs/VipMasterIC/IC/ECSI/ECSI-S-A0007299405/ECSI-S-A0007299405-1.pdf?src-supplier=IHS+Markit; ComponentLink2URL: https://ecsxtal.com/store/pdf/ECX-1637B.pdf?src-supplier=Digikey; ComponentLink2Description: https://ecsxtal.com/store/pdf/ECX-1637B.pdf?src-supplier=Digikey; ComponentLink3URL: https://datasheet.octopart.com/ECS-250-10-37B-CTN-TR-ECS-International-datasheet-163805537.pdf?src-supplier=Master+Electronics; ComponentLink3Description: https://datasheet.octopart.com/ECS-250-10-37B-CTN-TR-ECS-International-datasheet-163805537.pdf?src-supplier=Master+Electronics; Supplier Part Number 1: XC3065DKR-ND
Y?#2 = ECS-.327-7-16-C-TR: Parallel - Fundamental Quartz Crystal, 0.032768MHz Nom; Manufacturer: ECS International; Designed By: Kubilay Közleme; Supplier 1: Digikey; Manufacturer Part Number: ECS-.327-7-16-C-TR; RoHS: Yes; Category: LDO; Stock 1: 115000; Pricing 1: 5000=0.61472, 10000=0.58844, 15000=0.57362 (USD); Terminal Finish: Nickel; JESD-609 Code: e4; Crystal/Resonator Type: PARALLEL - FUNDAMENTAL; Reach SVHC Compliant: Yes; RoHS Compliant: Yes; ComponentLink1URL: https://datasheet.ciiva.com:443/pdfs/VipMasterIC/IC/ECSI/ECSI-S-A0004427997/ECSI-S-A0004427997-1.pdf?src-supplier=IHS+Markit; ComponentLink1Description: https://datasheet.ciiva.com:443/pdfs/VipMasterIC/IC/ECSI/ECSI-S-A0004427997/ECSI-S-A0004427997-1.pdf?src-supplier=IHS+Markit; ComponentLink2URL: http://www.ecsxtal.com/store/pdf/ECX-16.pdf?src-supplier=Digikey; ComponentLink2Description: http://www.ecsxtal.com/store/pdf/ECX-16.pdf?src-supplier=Digikey; Supplier Part Number 1: XC2842TR-ND